# EAGLE design bacchus2 (EAGLE 7.5.0)
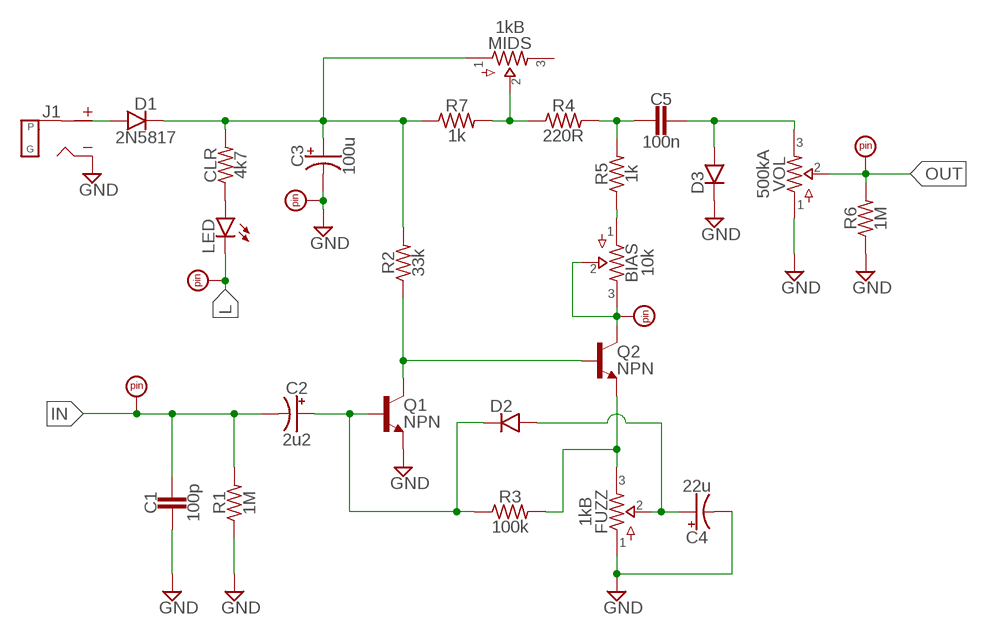
[diagram p0: schematic, sheet 1]

## Parts
BIAS  10k  POTSTRIM  [2262_TRIM]
C1  100p  CER/FILM2  [050X030_025_2]
C2  2u2  0501  [050_020_1]
C3  100u  0501  [050_020_1]
C4  22u  0501  [050_020_1]
C5  100n  CER/FILM2  [050X030_025_2]
CLR  4k7  R_.3B  [R0207/3]
D1  2N5817  DO41.3  [DO41-3]
D2  DO35.2  [DO35-2]
D3  DO35.2  [DO35-2]
FUZZ  1kB  POTS9MM_MOUNTED  [9MM_W/MOUNTS]
GND  PADRND  [ROUND]
IN  PADSQR  [SQUARE]
J1  DC_MONO  [DC]
L  PADRND  [ROUND]
LED  LEDB  [3MM_B]
MIDS  1kB  POTS9MM_MOUNTED  [9MM_W/MOUNTS]
OUT  PADSQR  [SQUARE]
Q1  NPN  2N1306  [TO5]
Q2  NPN  2N1306  [TO5]
R1  1M  R_.3B  [R0207/3]
R2  33k  R_.3B  [R0207/3]
R3  100k  R_.3B  [R0207/3]
R4  220R  R_.3B  [R0207/3]
R5  1k  R_.3B  [R0207/3]
R6  1M  R_.3B  [R0207/3]
R7  1k  R_.3B  [R0207/3]
TP  PADSQR  [SQUARE]
VOL  500kA  POTS9MM_MOUNTED  [9MM_W/MOUNTS]

## Nets
GND: C1.2 C3.- C4.- D3.C FUZZ.P$1 GND.1 J1.S(SLEEVE) Q1.1(E) R1.1 R6.1 VOL.P$1
IN: C1.1 C2.- IN.1 R1.2
L: L.1 LED.K(C)
N$1: C5.1 D3.A VOL.P$3
N$2: C2.+ D2.C Q1.2(B) R3.1
N$3: Q1.3(C) Q2.2(B) R2.1
N$4: D1.A J1.T(TIP)
N$5: C3.+ CLR.2 D1.C MIDS.P$1 R2.2 R7.1
N$6: MIDS.P$2 R4.1 R7.2
N$7: CLR.1 LED.A
N$8: C5.2 R4.2 R5.2
N$9: BIAS.1 R5.1
N$10: BIAS.2 BIAS.3 Q2.3(C) TP.1
N$14: FUZZ.P$3 Q2.1(E) R3.2
N$15: C4.+ D2.A FUZZ.P$2
OUT: OUT.1 R6.2 VOL.P$2
Unconnected: MIDS.P$3

## Library data of the parts
BIAS FUZZ MIDS VOL = potentiometers:POTS
C1 C5 = capacitors-film:CER/FILM: 47 - 120pF Xicon Ceramic Disc 2.5mm lead spacing
C2-C4 = capacitors-elec:050: 0.22 - 100uF Xicon values at Mouser.com: 10V: 10 - 100uF; 16V: 2.2 - 47uF; 25V: 0.47 - 47uF; 50V: 0.22 - 22uF
CLR R1-R7 = resistors:R_
D1 = diodes:DO41: DO-41 Package Diodes: 1N4001 - 1N40019 Zener Diodes: 1N4728 - 1N4764
D2 D3 = diodes:DO35: DO-35 Package Diodes: 1N914
GND IN L OUT TP = supply pins:PAD
J1 = jacks:DC_MONO
LED = diodes:LED
Q1 Q2 = transistors:2N1306: NPN Germanium

## Board
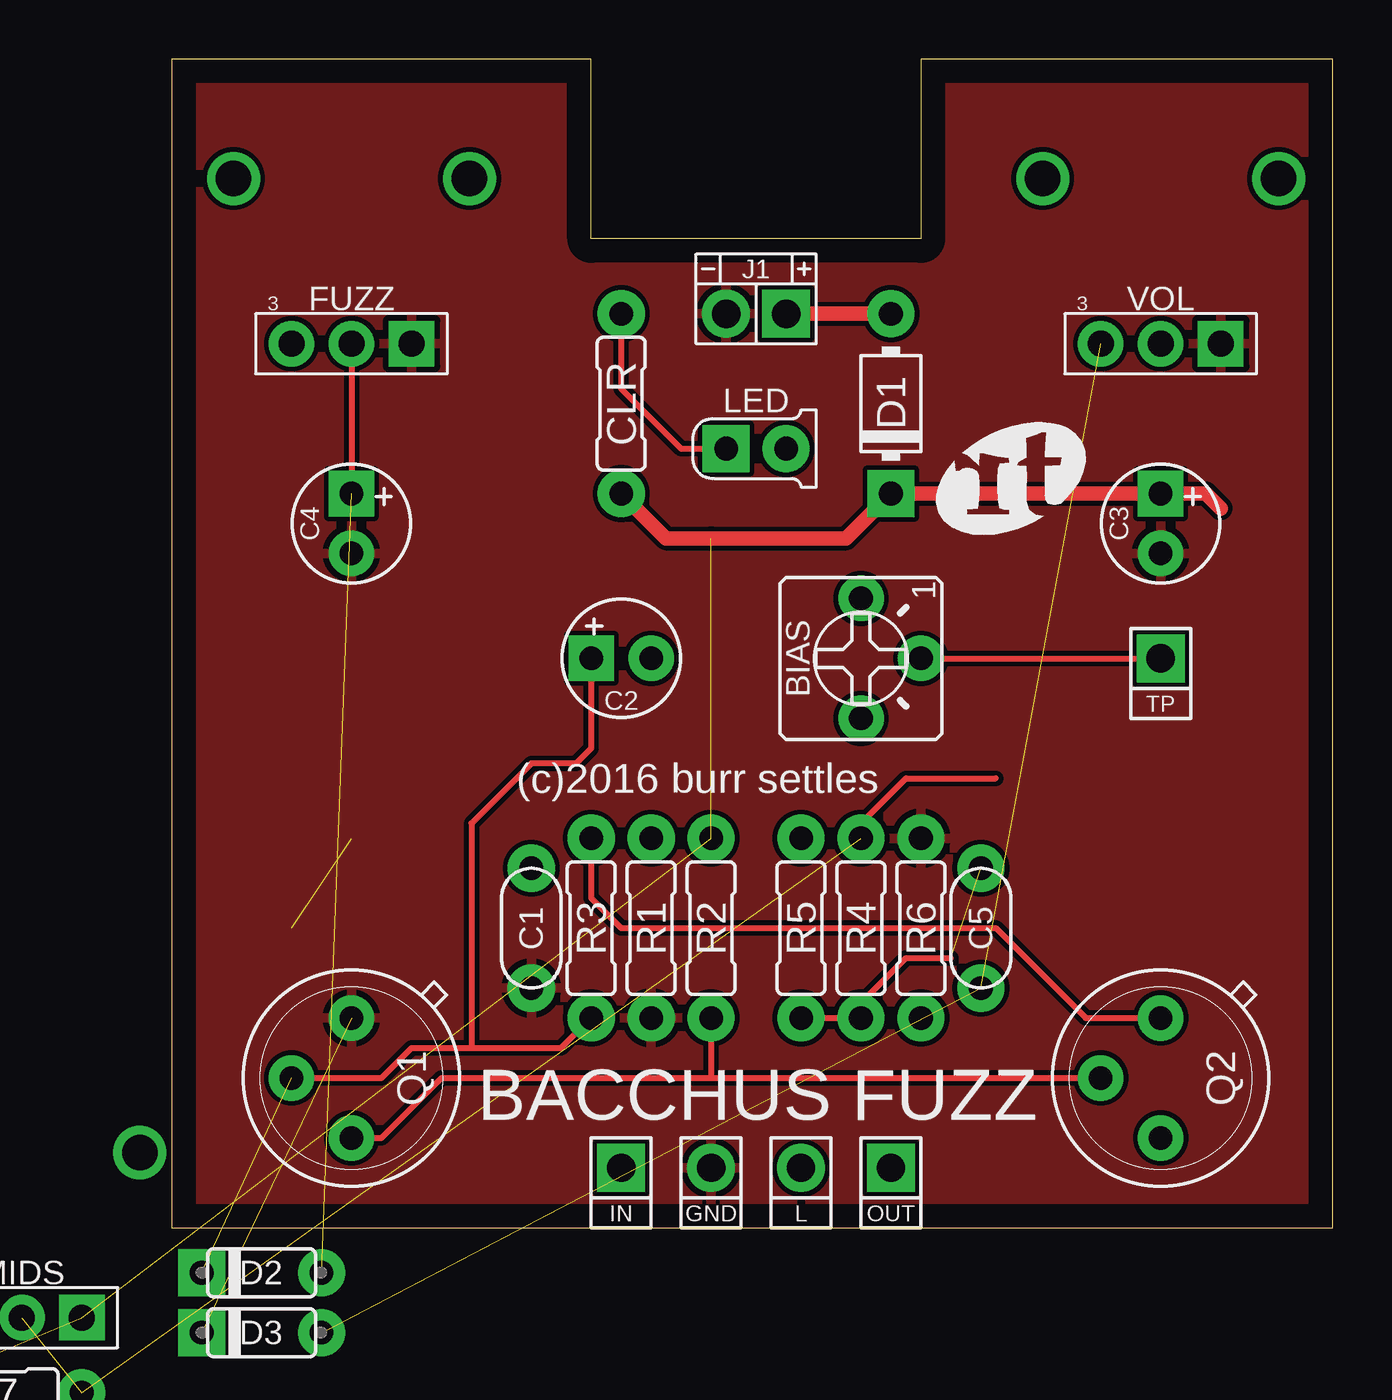
[diagram p1: board, top side]
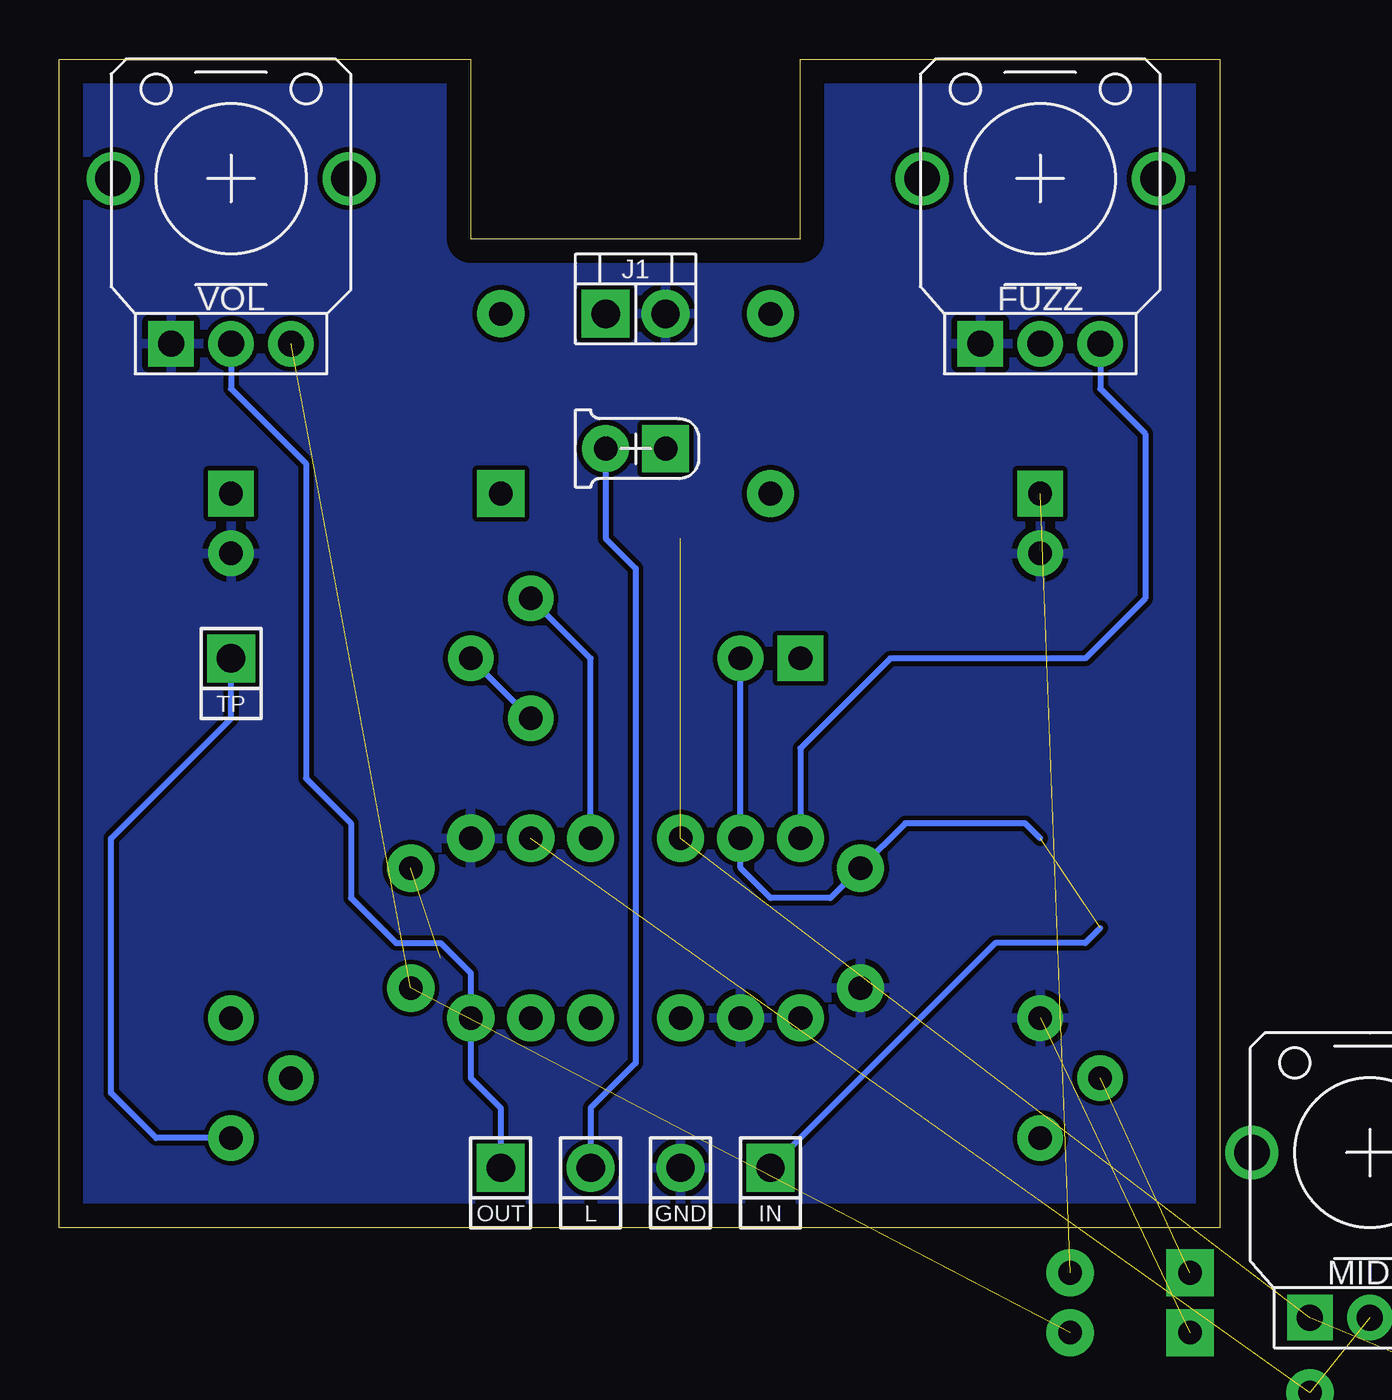
[diagram p2: board, bottom side, seen from below]

Size 49.2 x 49.53 mm. Coordinates in mm from the lower left corner, seen from the top.
Outline: 0,0 49.2,0 49.2,49.52 31.75,49.53 31.75,41.91 17.78,41.91 17.78,49.52 0,49.52 0,0
Copper layers (1*16): Top 0.035mm / dielectric 1.5mm / Bottom 0.035mm
Design rules "default": minimum track width 10mil, minimum drill 24mil, track to track 8mil, track to pad 8mil, pad to pad 8mil, via to via 8mil, smd to smd 8mil, copper to edge 40mil, drill to drill 8mil, minimum pad ring 10mil, minimum via ring 8mil, stop-mask expansion 4mil, vias tented up to drill 0mil, thermal gap 10mil

### Footprints (pad centres in the part's own frame; a part is rotated, then mirrored left to right if it is on the bottom)
2262_TRIM = drill 1 pad 1.93: 1 -2.54,0; 2 0,2.54; 3 2.54,0
050X030_025_2 = drill 1 pad 2: 1 -2.54,0; 2 2.54,0
050_020_1 = drill 1 pad 1.93 square: + -1.27,0 | drill 1 pad 1.93: - 1.27,0
R0207/3 = drill 1 pad 2: 1 -3.81,0; 2 3.81,0
DO41-3 = drill 1 pad 2: A 3.81,0 | drill 1 pad 2 square: C -3.81,0
DO35-2 = drill 1 pad 2: A 2.54,0 | drill 1 pad 2 square: C -2.54,0
9MM_W/MOUNTS = drill 1.1 pad 1.93 square: P$1 2.54,0 | drill 1.1 pad 1.93: P$2 0,0; P$3 -2.54,0 | drill 1.5: P$4 -5,7; P$5 5,7
ROUND = drill 1.2 pad 2.032: 1 0,0
SQUARE = drill 1.2 pad 2.032 square: 1 0,0
DC = drill 1.2 pad 2.032: S -1.27,0 | drill 1.2 pad 2.032 square: T 1.27,0
3MM_B = drill 1 pad 2 square: A -1.27,0 | drill 1 pad 2: K 1.27,0
TO5 = drill 1 pad 1.93: 1 0,-2.54; 2 2.54,0; 3 0,2.54

### Placement (x,y rotation side)
BIAS  29.21,24.13 270 top
C1  15.24,12.7 270 top
C2  19.05,24.13 0 top
C3  41.91,29.84 270 top
C4  7.62,29.84 270 top
C5  34.29,12.7 90 top
CLR  19.05,34.92 270 top
D1  30.48,34.92 90 top
D2  3.81,-1.91 0 top
D3  3.81,-4.45 0 top  (outside the outline)
FUZZ  7.62,37.47 0 top
GND  22.86,2.54 0 top
IN  19.05,2.54 0 top
J1  24.77,38.73 0 top
L  26.67,2.54 0 top
LED  24.77,33.02 0 top
MIDS  -6.35,-3.81 0 top
OUT  30.48,2.54 0 top
Q1  7.62,6.35 180 top
Q2  41.91,6.35 180 top
R1  20.32,12.7 90 top
R2  22.86,12.7 90 top
R3  17.78,12.7 90 top
R4  29.21,12.7 270 top
R5  26.67,12.7 270 top
R6  31.75,12.7 270 top
R7  -7.62,-6.99 0 top  (outside the outline)
TP  41.91,24.13 0 top
U$4  [RT0250]  35.56,31.75 0 top
VOL  41.91,37.47 0 top

### Tracks (layer width: path | path; a pad name or v marks a point on that pad's centre or on a via)
GND  (1 unrouted)
  pour Top: 0.64,48.9 17.14,48.9 17.14,41.27 32.38,41.27 32.38,48.9 48.9,48.9 48.9,0.64 0.64,0.64
  pour Bottom: 0.64,48.9 17.14,48.9 17.14,41.27 32.38,41.27 32.38,48.9 48.9,48.9 48.9,0.64 0.64,0.64
IN  (1 unrouted)
  Bottom 0.254: 5.08,12.7 5.71,12.06 9.53,12.06 IN.1 | 7.62,16.51 8.26,17.14 13.34,17.14 C1.1 16.51,13.97 19.05,13.97 20.32,15.24 R1.2 C2.-
L
  Bottom 0.254: LED.K 26.04,29.21 24.77,27.94 24.77,6.99 26.67,5.08 L.1
N$1  (2 unrouted)
N$2  (1 unrouted)
  Top 0.254: Q1.2 8.89,6.35 10.16,7.62 12.7,7.62 | 12.7,7.62 16.51,7.62 R3.1 | C2.+ 17.78,20.32 17.14,19.68 15.24,19.68 12.7,17.14 12.7,7.62
N$3
  Top 0.254: 22.86,6.35 11.43,6.35 8.89,3.81 Q1.3 | 22.86,6.35 Q2.2 | R2.1 22.86,6.35
N$4
  Top 0.61: J1.T D1.A
N$5  (3 unrouted)
  Top 0.61: CLR.2 20.95,29.21 22.86,29.21 28.57,29.21 D1.C C3.+ 43.81,31.11 44.45,30.48
N$6  (2 unrouted)
  Top 0.254: R4.1 29.21,17.14 31.11,19.05 34.92,19.05
N$7
  Top 0.254: CLR.1 19.05,35.56 21.59,33.02 LED.A
N$8  (1 unrouted)
  Top 0.254: R5.2 R4.2 29.21,9.53 31.11,11.43 33.02,11.43
N$9
  Bottom 0.254: R5.1 26.67,24.13 BIAS.1
N$10
  Top 0.254: BIAS.2 TP.1
  Bottom 0.254: Q2.3 45.09,3.81 46.99,5.71 46.99,16.51 41.91,21.59 TP.1 | BIAS.3 BIAS.2
N$14
  Top 0.254: R3.2 17.78,13.97 19.05,12.7 34.92,12.7 38.73,8.89 Q2.1
  Bottom 0.254: FUZZ.P$3 5.08,35.56 3.17,33.66 3.17,26.67 5.71,24.13 13.97,24.13 17.78,20.32 R3.2
N$15  (1 unrouted)
  Top 0.254: FUZZ.P$2 C4.+
OUT
  Bottom 0.254: OUT.1 30.48,5.08 31.75,6.35 R6.2 31.75,10.79 33.02,12.06 34.92,12.06 36.83,13.97 36.83,17.14 38.73,19.05 38.73,32.38 41.91,35.56 VOL.P$2

### Text on the board
tPlace: (c)2016 burr settles | BACCHUS FUZZ